# Altium project GEN3_FanCtrl_PROD_V03.PrjPcb (part 3 of 3)
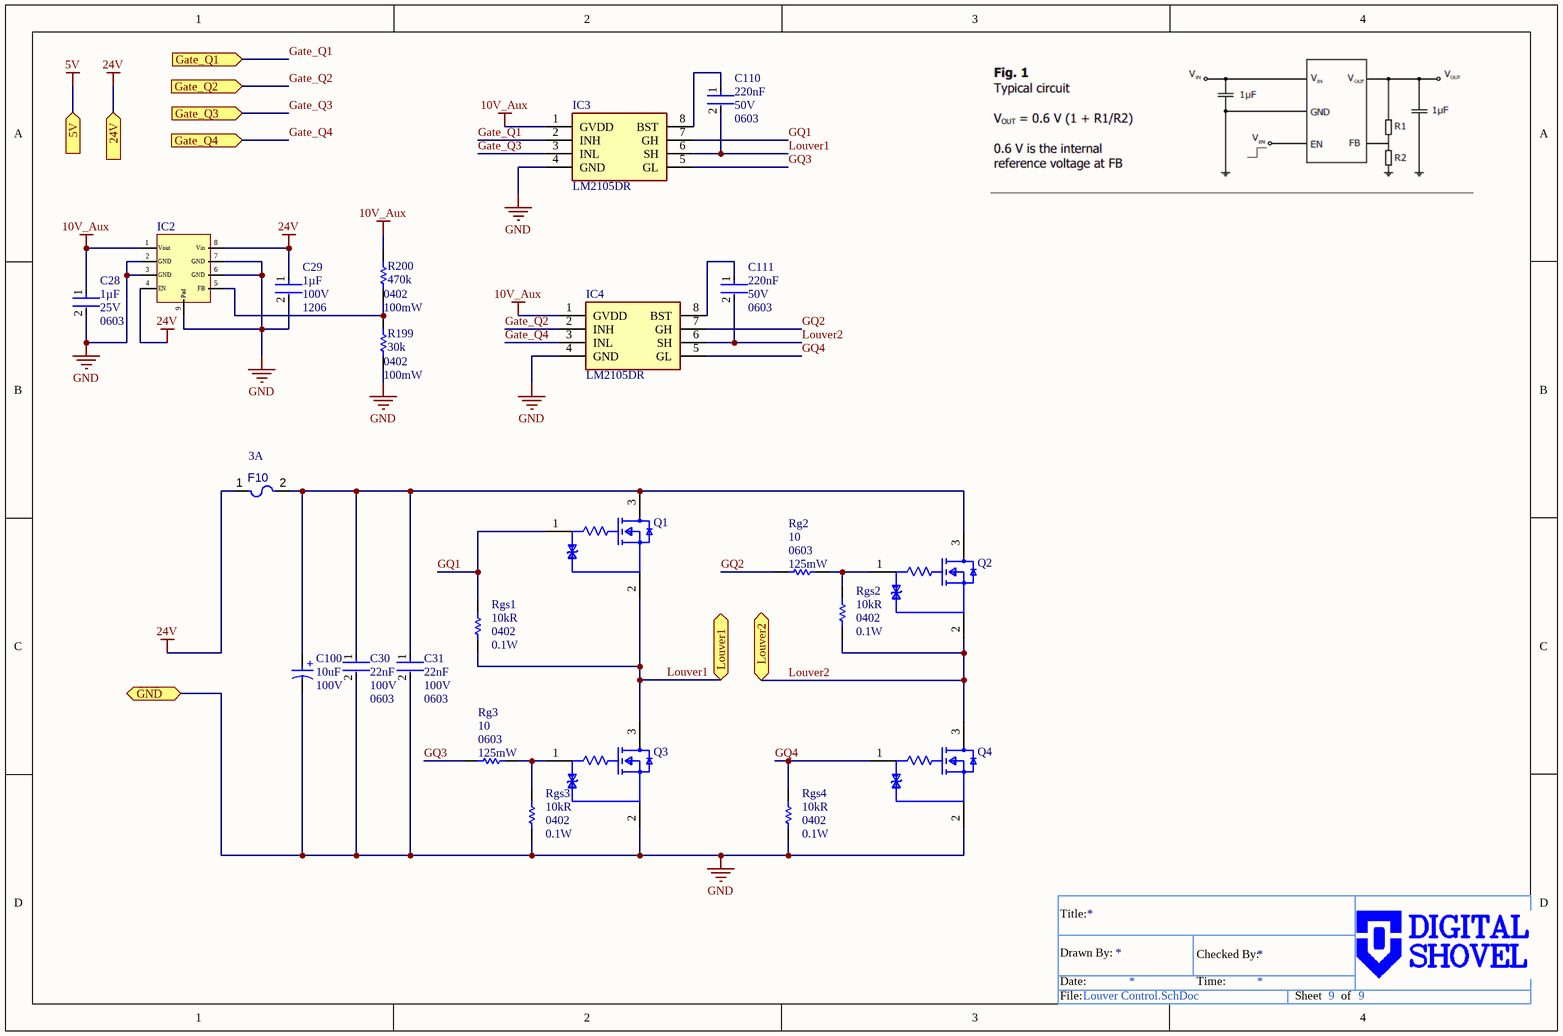
[diagram p11: Louver Control.SchDoc]

## Nets that join several sheets
3V3: MCU (8 pins), USB (22 pins)
5V: VoltageSensing (9 pins), Boost (C67.2 L1.1 R85.2 U20.6), Output (36 pins), MCU (24 pins), USB (C58.1 D1.1 U16.1 U16.3), ModBus (5 pins), DP (10 pins)
10V: Boost (C68.2 C69.1 D7.1 R86.2), Output (VR.1), MCU (C1.1 U1.5), DP (J5.02)
24V: Main.BoardSchDoc (T1.1), DP (J5.06), Louver Control (C29.1 F10.1 IC2.4 IC2.8)
GND: Main.BoardSchDoc (T1.2), VoltageSensing (20 pins), Boost (8 pins), Output (76 pins), MCU (46 pins), USB (49 pins), ModBus (6 pins), DP (16 pins), Louver Control (17 pins)
PE: Main.BoardSchDoc (1.1 5.1 6.1 In.4), Output (Out1.1 Out2.1 Out3.1)
~{C}S: MCU (R14.1 U5.71), DP (R28.1)
A: Main.BoardSchDoc (In.1 MOV1.2 MOV2.2), VoltageSensing (R48.2 R64.2), Output (6 pins)
AINA05: VoltageSensing (R57.2 R63.1 U13.4), MCU (U5.30)
AINA06: VoltageSensing (R36.2 R41.1 U11.4), MCU (U5.29)
AINA07: VoltageSensing (R47.2 R52.1 U12.4), MCU (U5.28)
B: Main.BoardSchDoc (In.2 MOV1.1 MOV3.2), VoltageSensing (R38.2 R53.2), Output (6 pins)
C: Main.BoardSchDoc (In.3 MOV2.1 MOV3.1), VoltageSensing (R43.2 R59.2), Output (6 pins)
DIR_Fan: MCU (U5.49), ModBus (P10.2)
DP_Fan: Output (P2.5 P3.5 P4.5), DP (J5.03)
Gate_Q1: MCU (U40.4), Louver Control (IC3.2)
Gate_Q2: MCU (U40.6), Louver Control (IC4.2)
Gate_Q3: MCU (U41.4), Louver Control (IC3.3)
Gate_Q4: MCU (U41.6), Louver Control (IC4.3)
INT17a: MCU (U5.65), DP (R23.1)
Louver1: Main.BoardSchDoc (T1.4), Louver Control (5 pins)
Louver2: Main.BoardSchDoc (T1.3), Louver Control (5 pins)
MISO: MCU (U5.74), DP (R26.1)
MOSI: MCU (U5.75), DP (R29.1)
PWM_FAN: Output (P2.1 P3.1 P4.1), MCU (R3.2 U1.4)
RSA_Fan1: Output (J3.2 J3.7 J4.5), ModBus (Rt1.2 U18.6 U19.2)
RSB_Fan1: Output (J3.1 J3.6 J4.4), ModBus (Rt1.1 U18.7 U19.1)
RXD_Fan: MCU (Prx.2 U5.50), ModBus (U18.1)
SCLK: MCU (U5.76), DP (R27.1)
TCK: MCU (U2.5), USB (U15.16)
TDI: MCU (U2.4), USB (U15.17)
TDO: MCU (U2.3), USB (U15.18)
TMS: MCU (U2.1), USB (U15.19)
TXD_Fan: MCU (Ptx.2 U5.51), ModBus (U18.4)
USB_RX: MCU (U4.4), USB (U15.39)
USB_TX: MCU (U3.3), USB (U15.38)